# EAGLE design e18_cc2652p (EAGLE 9.6.2)
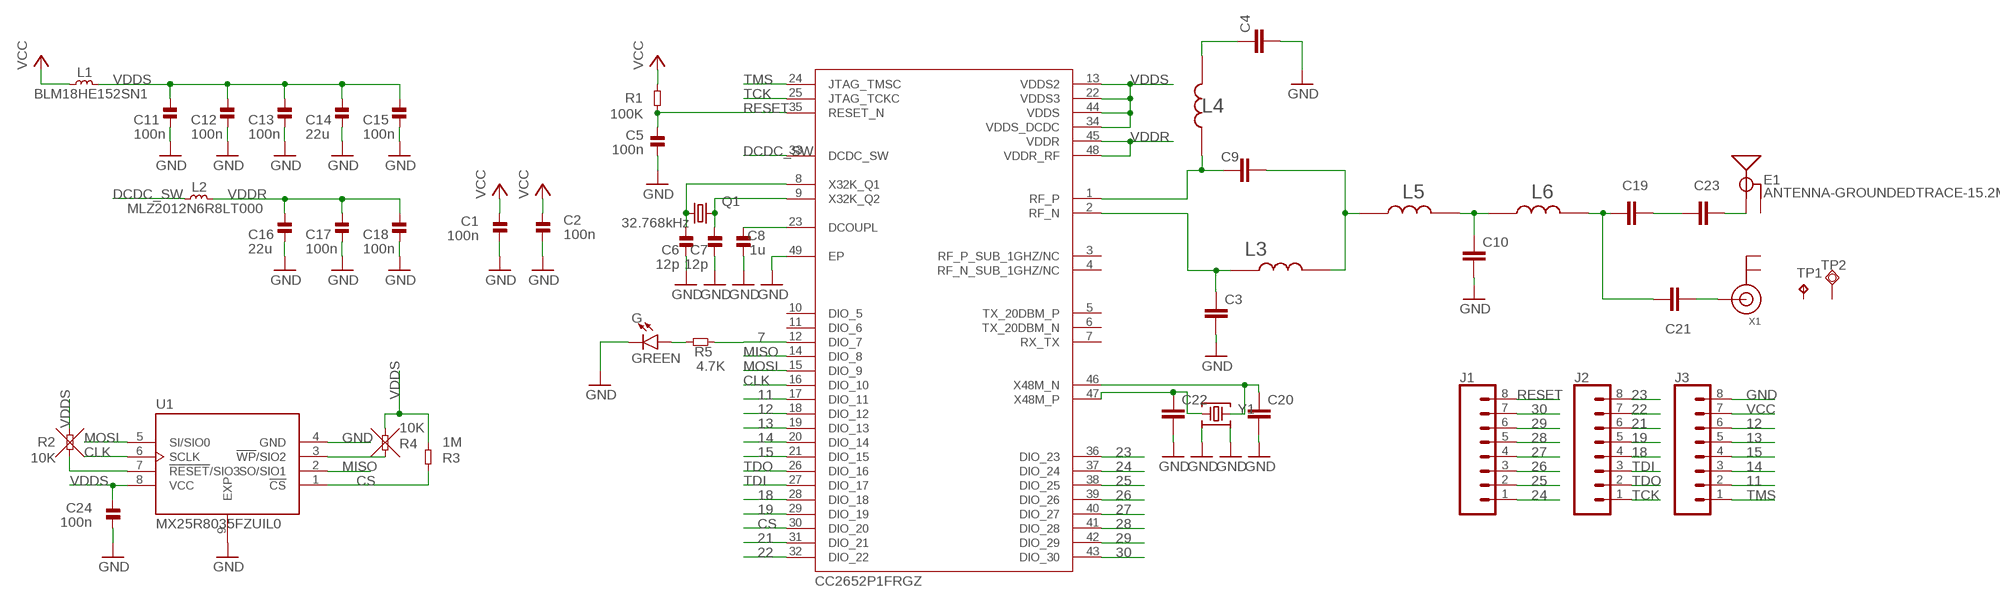
[diagram p0: schematic, sheet 1]

## Parts
C1  100n  CAP-0402  [_PKG_C_0402]
C2  100n  CAP-0402  [_PKG_C_0402]
C3  1pf  CAP0402  [CAPC1005X40N]
C4  12pf  CAP0402  [CAPC1005X40N]
C5  100n  CAP-0402  [_PKG_C_0402]
C6  12p  CAP-0402  [_PKG_C_0402]
C7  12p  CAP-0402  [_PKG_C_0402]
C8  1u  CAP-0402  [_PKG_C_0402]
C9  1pf  CAP0402  [CAPC1005X40N]
C10  1pf  CAP0402  [CAPC1005X40N]
C11  100n  CAP-0402  [_PKG_C_0402]
C12  100n  CAP-0402  [_PKG_C_0402]
C13  100n  CAP-0402  [_PKG_C_0402]
C14  22u  CAP-0805  [_PKG_C_0805]
C15  100n  CAP-0402  [_PKG_C_0402]
C16  22u  CAP-0805  [_PKG_C_0805]
C17  100n  CAP-0402  [_PKG_C_0402]
C18  100n  CAP-0402  [_PKG_C_0402]
C19  12pf  CAP0402  [CAPC1005X40N]
C20  6.8pf  CAP0402  [CAPC1005X40N]
C21  2.2pf  CAP0402  [CAPC1005X40N]
C22  6.8pf  CAP0402  [CAPC1005X40N]
C23  1.8pf  CAP0402  [CAPC1005X40N]
C24  100n  CAP-0402  [_PKG_C_0402]
E1  ANTENNA-GROUNDEDTRACE-15.2MM  [TRACE_ANTENNA_2.4GHZ_15.2MM]
G  GREEN  LED-GREEN0603  [LED-0603]
IC3  CC2652P1FRGZ  CC2652P1FRGZRRGZ0048A-MFG  [RGZ0048A-MFG]
J1  CONN_111X8-1.27MM  [1X11-1.27MM]
J2  CONN_111X8-1.27MM  [1X11-1.27MM]
J3  CONN_111X8-1.27MM  [1X11-1.27MM]
L1  BLM18HE152SN1  INDUCTOR-0603  [_PKG_L_0603]
L2  MLZ2012N6R8LT000  INDUCTOR-0805  [_PKG_C_0805]
L3  2.4nH  IND0402IND0402  [INDC1005X40N]
L4  2.4nH  IND0402IND0402  [INDC1005X40N]
L5  2nH  IND0402IND0402  [INDC1005X40N]
L6  2nH  IND0402IND0402  [INDC1005X40N]
Q1  32.768kHz  KX-327-RT  [2.0X1.2]
R1  100K  RES-0402  [_PKG_C_0402]
R2  10K  RES-0402  [_PKG_C_0402]
R3  1M  RES-0402  [_PKG_C_0402]
R4  10K  RES-0402  [_PKG_C_0402]
R5  4.7K  RES-0402  [_PKG_C_0402]
TP1  TPTP06SQ  [TP05SQ]
TP2  TPSQTP15SQ  [TP15SQ]
U1  MX25R8035FZUIL0  [PSON50P200X300X60-9N]
X1  ANTENNA_U.FL  [U.FL]
Y1  Q22FA12800150  48.000MHZ_CX2016DB48000C0FPLC1  [XTAL-4P-2016]

## Nets
7: IC3.12(DIO_7) R5.1
11: IC3.17(DIO_11) J3.2
12: IC3.18(DIO_12) J3.6
13: IC3.19(DIO_13) J3.5
14: IC3.20(DIO_14) J3.3
15: IC3.21(DIO_15) J3.4
18: IC3.28(DIO_18) J2.4
19: IC3.29(DIO_19) J2.5
21: IC3.31(DIO_21) J2.6
22: IC3.32(DIO_22) J2.7
23: IC3.36(DIO_23) J2.8
24: IC3.37(DIO_24) J1.1
25: IC3.38(DIO_25) J1.2
26: IC3.39(DIO_26) J1.3
27: IC3.40(DIO_27) J1.4
28: IC3.41(DIO_28) J1.5
29: IC3.42(DIO_29) J1.6
30: IC3.43(DIO_30) J1.7
CLK: IC3.16(DIO_10) U1.6(SCLK)
CS: IC3.30(DIO_20) R3.2 U1.1(!CS)
DCDC_SW: IC3.33(DCDC_SW) L2.1
GND: C1.1 C2.1 C3.2 C4.2 C5.1 C6.1 C7.1 C8.1 C10.2 C11.2 C12.2 C13.2 C14.2 C15.2 C16.2 C17.2 C18.2 C20.2 C22.2 C24.1 G.C IC3.49(EP) J3.8 U1.4(GND) U1.9(EXP) Y1.2 Y1.4
MISO: IC3.14(DIO_8) U1.2(SO/SIO1)
MOSI: IC3.15(DIO_9) U1.5(SI/SIO0)
N$1: C9.1 IC3.1(RF_P) L4.1
N$2: C3.1 IC3.2(RF_N) L3.1
N$3: C4.1 L4.2
N$4: C9.2 L3.2 L5.1
N$5: C19.1 C21.1 L6.2
N$6: C21.2 X1.3(SIGNAL)
N$7: C19.2 C23.1
N$8: C23.2 E1.ANT(SIGNAL)
N$9: C8.2 IC3.23(DCOUPL)
N$10: C10.1 L5.2 L6.1
N$11: R2.1 U1.7(!RESET!/SIO3)
N$12: C20.1 IC3.46(X48M_N) Y1.3
N$13: R4.2 U1.3(!WP!/SIO2)
N$14: G.A R5.2
N$15: C22.1 IC3.47(X48M_P) Y1.1
RESET: C5.2 IC3.35(RESET_N) J1.8 R1.1
TCK: IC3.25(JTAG_TCKC) J2.1
TDI: IC3.27(DIO_17) J2.3
TDO: IC3.26(DIO_16) J2.2
TMS: IC3.24(JTAG_TMSC) J3.1
VCC: C1.2 C2.2 J3.7 L1.1 R1.2
VDDR: C16.1 C17.1 C18.1 IC3.45(VDDR) IC3.48(VDDR_RF) L2.2
VDDS: C11.1 C12.1 C13.1 C14.1 C15.1 C24.2 IC3.13(VDDS2) IC3.22(VDDS3) IC3.34(VDDS_DCDC) IC3.44(VDDS) L1.2 R2.2 R3.1 R4.1 U1.8(VCC)
X32K_Q1: C6.2 IC3.8(X32K_Q1) Q1.1
X32K_Q2: C7.2 IC3.9(X32K_Q2) Q1.2
Unconnected: E1.GND IC3.3(RF_P_SUB_1GHZ/NC) IC3.4(RF_N_SUB_1GHZ/NC) IC3.5(TX_20DBM_P) IC3.6(TX_20DBM_N) IC3.7(RX_TX) IC3.10(DIO_5) IC3.11(DIO_6) TP1.TP TP2.TP X1.1(GND) X1.2(GND)

## Library data of the parts
C1 C2 C5-C8 C11-C18 C24 = ok-discretes-dev:CAP
C3 C4 C9 C10 C19-C23 = discretes-dev:CAP0402: CAP, 0402; AVAILABILITY: Good; DESCRIPTION: RESISTOR, 0402 0.063W 1% 3M6; Resistance:3.6Mohm; Resistance Tolerance:± 1%; Power Rating:0.063W; Voltage Rating:50V; Series:RC32H; Temperature Coefficient:± 100ppm/°C; Resistor Element Type:Thick Film; Resistor Case Style:0402; No. of Pins:2; SVHC:No SVHC; Case Style:0402; External Length / Height:1mm; Temperature Coeff. +:100ppm/°C; Temperature Coeff. -:100ppm/°C; External Depth:0.35mm; External Width:0.5mm; Operating Temperature Range:-55°C to +155°C; Overload Voltage:100V; MF: Yageo; MP: RC0402FR-073M6L; PACKAGE: 1005 Panasonic Electronic Components; PRICE: None; PURCHASE-URL: https://pricing.snapeda.com/search/part/RC0402FR-073M6L/?ref=eda
E1 = SparkFun-RF2:ANTENNA-GROUNDED: Antenna w/ Ground Connection 2.4GHz antennae with signal and ground terminals. TRACE_ANTENNA_2.4GHZ_15.2MM - Meander Trace antenna 15.2 x 5.7mm footprint Based on layout from TI app note AN043 <http://www.ti.com/lit/an/swra117d/swra117d.pdf>. TRACE_ANTENNA_2.4GHZ_25.7MM - Inverted F trace antenna 25.7 x 7.5 mm footprint. Based on layout from TI design note DN0007 <http://www.ti.com/lit/an/swru120b/swru120b.pdf>.
G = SparkFun-LED:LED-GREEN: Green SMD LED Used in manufacturing of various products at SparkFun Packages: 0603 - SMD 0603 package [Product Link] <http://www.futureelectronics.com/en/technologies/semiconductors/optoelectronics/leds/Pages/9894312-LTST-C190GKT.aspx?CrossPart=HSMG-C190&IM=0> LilyPad 1206 - SMD1206 LilyPad package [Product Link] <http://www.futureelectronics.com/en/Technologies/Product.aspx?ProductID=IN150NGHARVATEKCORPORATION2049943&IM=0> 1206 - SMD1206 package [Product Link] <http://www.futureelectronics.com/en/technologies/semiconductors/optoelectronics/leds/Pages/8315665-LTST-C150KGKT.aspx?IM=0> 1206 Bottom Mount -SMD 1206 Bottom Mount [Product Link] <http://www.digikey.com/product-detail/en/lite-on-inc/LTST-C230KGKT/160-1456-1-ND/386854> SparkFun Products: Pro Mini 328 -5V <https://www.sparkfun.com/products/821> RedBoard <https://www.sparkfun.com/products/12757> MP3 Trigger <https://www.sparkfun.com/products/13720> Makey Makey <https://www.sparkfun.com/products/11076>; PROD_ID: DIO-00821
IC3 = CC2652P1FRGZR:CC2652P1FRGZR; COPYRIGHT: Copyright (C) 2022 Ultra Librarian. All rights reserved.; MANUFACTURER_PART_NUMBER: CC2652P1FRGZR; MFR_NAME: Texas Instruments; REFDES: RefDes; TYPE: TYPE
J1-J3 = SparkFun-Connectors:CONN_11: Multi connection point. Often used as Generic Header-pin footprint for 0.1 inch spaced/style header connections On any of the 0.1 inch spaced packages, you can populate with these: Break Away Headers - Straight <https://www.sparkfun.com/products/116> (PRT-00116) Break Away Male Headers - Right Angle <https://www.sparkfun.com/products/553> (PRT-00553) Female Headers <https://www.sparkfun.com/products/115> (PRT-00115) Break Away Headers - Machine Pin <https://www.sparkfun.com/products/117> (PRT-00117) Break Away Female Headers - Swiss Machine Pin <https://www.sparkfun.com/products/743> (PRT-00743) For SCREWTERMINALS and SPRING TERMINALS visit here: Screw Terimnals on SparkFun.com <https://www.sparkfun.com/search/results?term=Screw+Terminals> (5mm/3.5mm/2.54mm spacing) This device is also useful as a general connection point to wire up your design to another part of your project. Our various solder wires solder well into these plated through hole pads. Hook-Up Wire - Assortment (Stranded, 22 AWG) <https://www.sparkfun.com/products/11375> (PRT-11375) Hook-Up Wire - Assortment (Solid Core, 22 AWG) <https://www.sparkfun.com/products/11367> (PRT-11367) View the entire wire category on our website here <https://www.sparkfun.com/categories/141>
L1 L2 = ok-discretes-dev:INDUCTOR
L3-L6 = discretes-dev:IND0402: RESISTOR, 0402 0.063W 1% 3M6; Resistance:3.6Mohm; Resistance Tolerance:± 1%; Power Rating:0.063W; Voltage Rating:50V; Series:RC32H; Temperature Coefficient:± 100ppm/°C; Resistor Element Type:Thick Film; Resistor Case Style:0402; No. of Pins:2; SVHC:No SVHC; Case Style:0402; External Length / Height:1mm; Temperature Coeff. +:100ppm/°C; Temperature Coeff. -:100ppm/°C; External Depth:0.35mm; External Width:0.5mm; Operating Temperature Range:-55°C to +155°C; Overload Voltage:100V Check prices <https://pricing.snapeda.com/parts/RC0402FR-073M6L/Yageo/view-part?ref=eda>; AVAILABILITY: Good; DESCRIPTION: RESISTOR, 0402 0.063W 1% 3M6; Resistance:3.6Mohm; Resistance Tolerance:± 1%; Power Rating:0.063W; Voltage Rating:50V; Series:RC32H; Temperature Coefficient:± 100ppm/°C; Resistor Element Type:Thick Film; Resistor Case Style:0402; No. of Pins:2; SVHC:No SVHC; Case Style:0402; External Length / Height:1mm; Temperature Coeff. +:100ppm/°C; Temperature Coeff. -:100ppm/°C; External Depth:0.35mm; External Width:0.5mm; Operating Temperature Range:-55°C to +155°C; Overload Voltage:100V; MF: Yageo; MP: RC0402FR-073M6L; PACKAGE: 1005 Panasonic Electronic Components; PRICE: None; PURCHASE-URL: https://pricing.snapeda.com/search/part/RC0402FR-073M6L/?ref=eda
Q1 = crystal-geyer_V1_0:KX-327: Tuning Fork Crystals (kHz) SMD: KX327 - Serie Model Size l/w/h [mm] Frequency Range Frequency Stability Temp. Range [°C] Load Capacitance AECQ 200 availabel Datasheet KX-327VT KX-327FT KX-327RT KX-327NHT KX-327NHF KX-327L KX-327S 1.25/1.05/0.5 1.6/1.0/0.5 2.0/1.2/0.6 3.2/1.5/0.8 3.2/1.5/0.8 7.0/1.5/1.4 8.2/3.8/2.5 32,768 kHz 32,768 kHz 32,768 kHz 32,768 kHz 32,768 kHz 32,768 kHz 32,768 kHz ±10 … ±20ppm ±10 … ±20ppm ±10 … ±20ppm ±10 … ±20ppm ±10 … ±20ppm ±10 … ±20ppm ±5 … ±20ppm (*) -40°C …+85°C (*) -40°C …+85°C (*) -40°C …+85°C (*) -40°C …+85°C (*) -40°C …+125°C (*) -40°C …+85°C (*) -40°C …+85°C 7/9/12,5 7/9/12,5 7/9/12,6 7/9/12,5 9/12,5 7/9/12,5 6/12,5 - - - - yes - - KX-327VT.pdf <http://www.geyer-electronic.de/uploads/tx_userartikelfrequenz/GEYER-KX-327VT.pdf> KX-327FT.pdf <http://www.geyer-electronic.de/uploads/tx_userartikelfrequenz/GEYER-KX-327FT.pdf> KX-327RT.pdf <http://www.geyer-electronic.de/uploads/tx_userartikelfrequenz/GEYER-KX-327RT.pdf> KX-327NHT.pdf <http://www.geyer-electronic.de/uploads/tx_userartikelfrequenz/GEYER-KX-327NHT.pdf> KX-327NHF.pdf <http://www.geyer-electronic.de/uploads/tx_userartikelfrequenz/GEYER-KX-327NHF.pdf> KX-327L.pdf <http://www.geyer-electronic.de/uploads/tx_userartikelfrequenz/GEYER-KX-327L.pdf> KX-327S.pdf <http://www.geyer-electronic.de/uploads/tx_userartikelfrequenz/GEYER-KX-327S.pdf> <http://www.geyer-electronic.de/fileadmin/template/img/logo-geyer-electronic.png> Details see: http://www.geyer-electronic.de/Frequenz-Produkte.9.0.html Created 2016-06-07, Hans Locher 2016 (C) Geyer Quartz Technology KX327VT,KX327FT,KX327RT,KX327NHT,KX327NHF,KX327S,KX327L;125105;1610;2012;3215;7015;8238;1,25x1,05,1.25x1.05;1,6x1,0,1.6x1.0;2,0x1,2,2.0x1.2;3,2x1,5,3.2x1.5;8,2x3,8,8.2x3.8,7.0x1.5,7,0x1,532.768kHz
R1-R5 = ok-discretes-dev:RES
TP1 = testpad:TP: Test pad
TP2 = testpad:TPSQ: Test pad
U1 = MX25R8035FZUIL0:MX25R8035FZUIL0: FLASH - NOR Memory IC 8Mb (1M x 8) SPI - Quad I/O 33 MHz 8-USON (2x3) Check availability <https://pricing.snapeda.com/parts/MX25R8035FZUIL0/Macronix/view-part?ref=eda>; AVAILABILITY: In Stock; DESCRIPTION: NOR Flash Serial 1.8V/3.3V 8M-bit 8M/4M/2M x 1/2-bit/4-bit 12ns 8-Pin USON EP; MF: Macronix; MP: MX25R8035FZUIL0; PACKAGE: None; PRICE: None; PURCHASE-URL: https://pricing.snapeda.com/search/part/MX25R8035FZUIL0/?ref=eda
X1 = adafruit:ANTENNA_U.FL: U.FL Antenna Connector
Y1 = ok-xtal-osc-dev:48.000MHZ_CX2016DB48000C0FPLC1: 48MHz ±10ppm Crystal 7pF 50 Ohms 4-SMD, No Lead Datasheet <https://media.digikey.com/pdf/Data%20Sheets/Kyocera%20International/CX2016DB48000C0FPLC1_DS.pdf>; DIGIKEY_PART: 1253-2042-1-ND; MFG_NAME: KYOCERA; MFG_PART: CX2016DB48000C0FPLC1

## Board
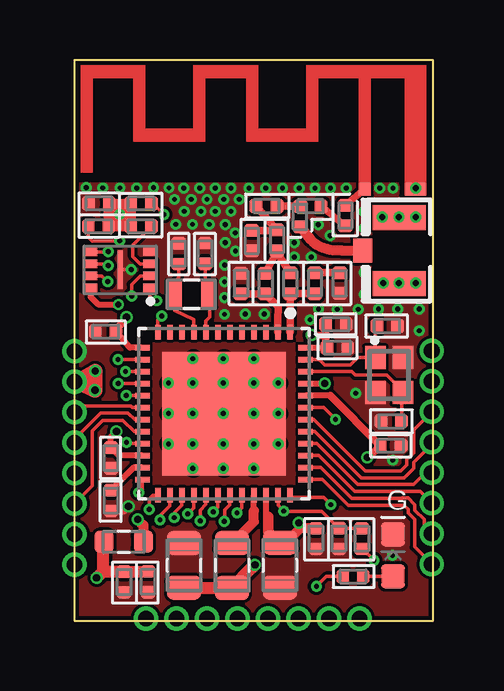
[diagram p1: board, top side]
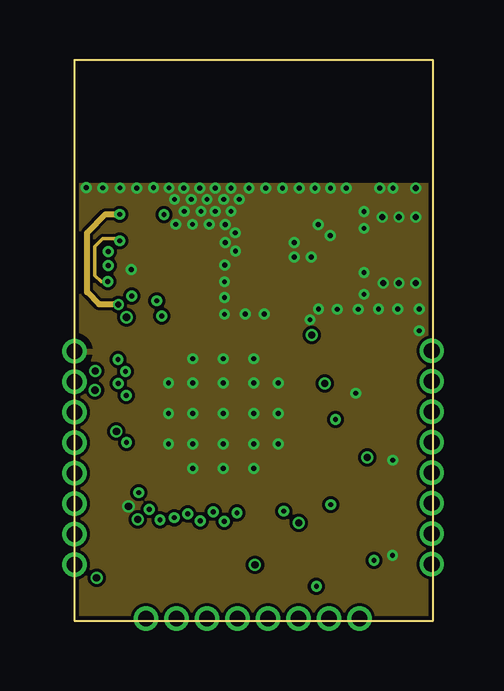
[diagram p2: board, inner layer Route2]
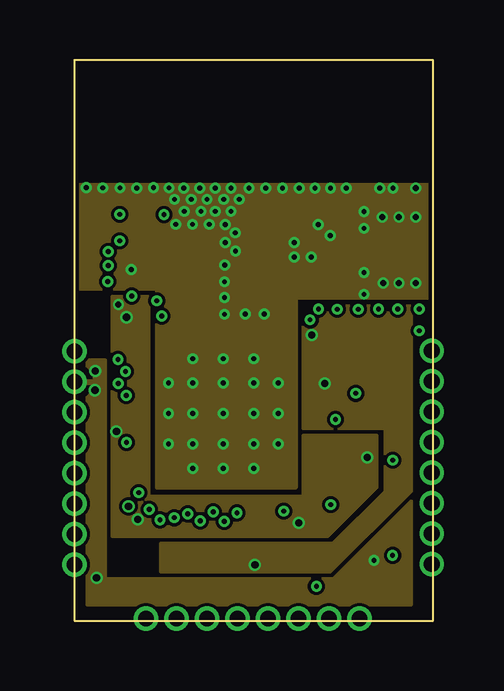
[diagram p3: board, inner layer Route15]
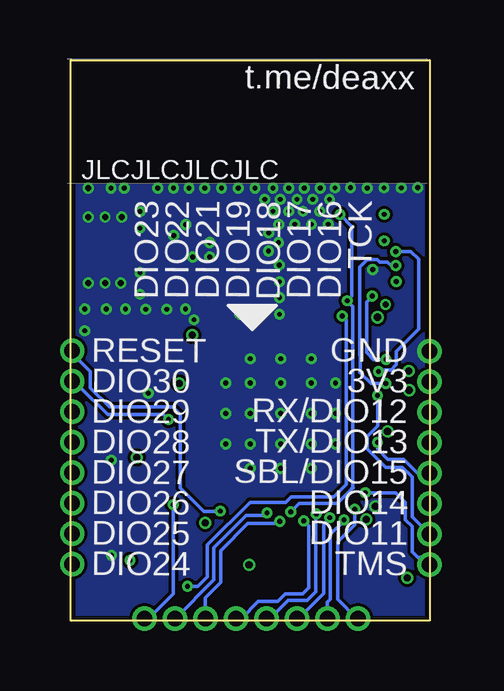
[diagram p4: board, bottom side, seen from below]

Size 14.95 x 23.38 mm. Coordinates in mm from the lower left corner, seen from the top.
Outline: 14.95,0 14.95,23.38 0,23.38 0,0 14.95,0
Copper layers (1*2*15*16): Top 0.035559375mm / dielectric 0.17018125mm / Route2 0.01778125mm / dielectric 0.4mm / Route15 0.01778125mm / dielectric 0.17018125mm / Bottom 0.035559375mm
Design rules "oshpark-4layer *": minimum track width 6mil, minimum drill 0.2mm, track to track 5mil, track to pad 5mil, pad to pad 5mil, via to via 5mil, smd to smd 5mil, copper to edge 0.16mm, drill to drill 0.2mm, minimum pad ring 4mil, minimum via ring 4mil, stop-mask expansion 0.05841875mm, vias tented up to drill 50mil, thermal gap 10mil
tRestrict: area 4.5,13.1 to 5.3,14.2; 1 lines

### Footprints (pad centres in the part's own frame; a part is rotated, then mirrored left to right if it is on the bottom)
_PKG_C_0402 = smd 0.54 x 0.6: 1 -0.43,0; 2 0.43,0
CAPC1005X40N = smd 0.54 x 0.6: 1 -0.432,0; 2 0.432,0
_PKG_C_0805 = smd 1 x 1.42: 1 -0.935,0; 2 0.935,0
TRACE_ANTENNA_2.4GHZ_15.2MM = smd 0.5 x 0.5: ANT -3.127,-0.25 | smd 0.9 x 0.5: GND -1.027,-0.25
LED-0603 = smd 1 x 1: A -0.877,0; C 0.877,0
RGZ0048A-MFG = smd 0.6 x 0.24: 1 -3.4,2.75; 2 -3.4,2.25; 3 -3.4,1.75; 4 -3.4,1.25; 5 -3.4,0.75; 6 -3.4,0.25; 7 -3.4,-0.25; 8 -3.4,-0.75; 9 -3.4,-1.25; 10 -3.4,-1.75; 11 -3.4,-2.25; 12 -3.4,-2.75; 25 3.4,-2.75; 26 3.4,-2.25; 27 3.4,-1.75; 28 3.4,-1.25; 29 3.4,-0.75; 30 3.4,-0.25; 31 3.4,0.25; 32 3.4,0.75; 33 3.4,1.25; 34 3.4,1.75; 35 3.4,2.25; 36 3.4,2.75 | smd 0.24 x 0.6: 13 -2.75,-3.4; 14 -2.25,-3.4; 15 -1.75,-3.4; 16 -1.25,-3.4; 17 -0.75,-3.4; 18 -0.25,-3.4; 19 0.25,-3.4; 20 0.75,-3.4; 21 1.25,-3.4; 22 1.75,-3.4; 23 2.25,-3.4; 24 2.75,-3.4; 37 2.75,3.4; 38 2.25,3.4; 39 1.75,3.4; 40 1.25,3.4; 41 0.75,3.4; 42 0.25,3.4; 43 -0.25,3.4; 44 -0.75,3.4; 45 -1.25,3.4; 46 -1.75,3.4; 47 -2.25,3.4; 48 -2.75,3.4 | smd 5.15 x 5.15: 49 0,0 | smd 0.5 x 0.5: 50 1.26,-2.325; 51 0,-2.325; 52 -1.26,-2.325; 53 1.26,2.325; 54 0,2.325; 55 -1.26,2.325; 56 2.325,-1.26; 57 2.325,0; 58 2.325,1.26; 59 -2.325,-1.26; 60 -2.325,0; 61 -2.325,1.26; 62 0,-1.26; 63 0.025,0; 64 0,1.26; 65 1.26,-1.26; 66 1.26,0; 67 1.26,1.26; 68 -1.26,-1.26; 69 -1.26,0; 70 -1.26,1.26
1X11-1.27MM = drill 0.65 pad 1.016: 1 0,0; 2 1.27,0; 3 2.54,0; 4 3.81,0; 5 5.08,0; 6 6.35,0; 7 7.62,0; 8 8.89,0
_PKG_L_0603 = smd 0.79 x 0.93: 1 -0.82,0; 2 0.82,0
INDC1005X40N = smd 0.54 x 0.6: 1 -0.432,0; 2 0.432,0
2.0X1.2 = smd 0.6 x 1.1: 1 -0.7,0; 2 0.7,0
TP05SQ = smd 0.5 x 0.5: TP 0,0
TP15SQ = smd 0.5 x 0.9: TP 0,0
PSON50P200X300X60-9N = smd 0.56 x 0.35: 1 -1.235,0.75; 2 -1.235,0.25; 3 -1.235,-0.25; 4 -1.235,-0.75; 5 1.235,-0.75; 6 1.235,-0.25; 7 1.235,0.25; 8 1.235,0.75 | smd 0.2 x 1.6: 9 0,0
U.FL = smd 2.2 x 1.05: 1 0,1.375; 2 0,-1.375 | smd 0.8 x 1: 3 1.525,0
XTAL-4P-2016 = smd 0.95 x 0.85: 1 -0.725,-0.575; 2 0.725,-0.575; 3 0.725,0.575; 4 -0.725,0.575

### Placement (x,y rotation side)
C1  2.08,1.61 90 top
C2  3.07,1.62 90 top
C3  6.94,14.06 90 top
C4  11.06,14.07 270 top
C5  11.03,3.42 90 top
C6  5.45,15.31 269.9 top
C7  4.35,15.3 270 top
C8  1.54,5.01 90 top
C9  9,14.06 90 top
C10  7.4,15.84 270 top
C11  1.31,12.05 180 top
C12  1.53,6.78 270 top
C13  13.18,7.29 0 top
C14  8.57,2.31 270 top
C15  10.07,3.42 270 top
C16  4.57,2.3 90 top
C17  10.96,11.38 0 top
C18  10.9,12.35 0 top
C19  9.85,17.27 0 top
C20  13.21,8.32 180 top
C21  9.41,16.84 270 top
C22  13.04,12.28 0 top
C23  11.29,16.88 90 top
C24  1.03,17.4 0 top
E1  15.24,18.23 0 top
G  13.28,2.72 90 top
IC3  6.24,8.63 270 top
J1  14.9,2.36 90 top
J2  2.99,0.08 0 top
J3  0.02,2.34 90 top
L1  2.06,3.29 0 top
L2  6.58,2.3 270 top
L3  7.96,14.05 90 top
L4  10.02,14.06 90 top
L5  8.44,15.86 90 top
L6  8.01,17.28 0 top
Q1  4.88,13.61 180 top
R1  11.98,3.42 270 top
R2  1.01,16.44 0 top
R3  2.79,17.4 0 top
R4  2.79,16.44 0 top
R5  11.62,1.84 0 top
TP1  12.11,17.99 0 top
TP2  14.22,17.98 90 top
U1  1.91,14.63 180 top
X1  13.54,15.43 180 top
Y1  13.12,10.24 270 top

### Tracks (layer width: path | path; a pad name or v marks a point on that pad's centre or on a via)
7  (via drill 0.2 pad 0.45)
  Top 0.152: IC3.12 3.49,12.54 v3.65,12.7 | R5.1 10.5,1.84 v10.09,1.43
  Bottom 0.152: v3.65,12.7 v3.64,12.7 3.48,12.53 3.48,5.67 3.99,5.16 5.77,5.16 6,4.93 7.49,4.93 9.27,3.15 9.27,1.82 9.66,1.43 v10.09,1.43
11  (via drill 0.2 pad 0.45)
  Top 0.152: IC3.17 v2.17,9.38
  Bottom 0.152: v2.17,9.38 2.17,8.11 2.6,7.68 2.6,7.15 1.84,6.38 1.14,6.38 0.74,5.98 0.74,4.33 J3.2
12
  Top 0.152: IC3.18 2.41,8.88 2.35,8.95 0.28,8.95 J3.6
13
  Top 0.152: IC3.19 2.52,8.38 2.23,8.67 1.11,8.67 0.02,7.57 J3.5
14
  Top 0.152: IC3.20 2.49,7.88 2.02,8.36 1.19,8.36 0.75,7.92 0.75,5.61 J3.3
15  (via drill 0.2 pad 0.45)
  Top 0.152: IC3.21 2.23,7.38 v2.17,7.43
  Bottom 0.152: v2.17,7.43 2.17,7.16 1.74,6.73 1.08,6.73 0.5,6.15 J3.4
18  (via drill 0.2 pad 0.45)
  Top 0.152: IC3.28 4.99,4.71 v4.73,4.45
  Bottom 0.152: v4.73,4.45 4.75,4.44 4.75,1.2 5.1,0.85 5.9,0.85 6.66,0.08 J2.4
19  (via drill 0.2 pad 0.45)
  Top 0.152: IC3.29 5.49,4.84 5.25,4.6 v5.25,4.15 | v5.25,4.15
  Bottom 0.152: 7.83,0.08 J2.5 7.86,0.08 7.14,0.8 6.34,0.8 6.02,1.13 5.29,1.13 5.05,1.37 5.05,3.95 v5.25,4.15
21  (via drill 0.2 pad 0.45)
  Top 0.152: IC3.31 6.49,4.83 6.26,4.61 6.26,4.15 v6.25,4.14
  Bottom 0.152: v6.25,4.14 6.34,4.05 7.58,4.05 8.71,2.92 8.71,1.59 9.34,0.96 J2.6
22  (via drill 0.2 pad 0.45)
  Top 0.152: IC3.32 6.99,4.69 v6.78,4.49
  Bottom 0.152: v6.78,4.49 v6.79,4.49 6.89,4.38 7.64,4.38 8.99,3.03 8.99,1.71 J2.7
23  (via drill 0.2 pad 0.45)
  Top 0.152: v10.69,4.83 10.39,5.13 9.08,5.13 IC3.36
  Bottom 0.152: v10.69,4.83 10.69,1.13 11.73,0.08 J2.8
24
  Top 0.152: IC3.37 10.33,5.88 11.41,4.81 13.74,4.81 13.91,4.63 13.91,4.49 14.19,4.21 14.19,3.07 J1.1
25
  Top 0.152: 14.89,3.63 J1.2 14.57,3.95 14.57,4.22 14.19,4.61 14.19,4.83 13.91,5.11 13.66,5.11 13.66,5.1 11.56,5.1 10.28,6.38 IC3.38
26
  Top 0.152: IC3.39 10.19,6.88 11.69,5.39 14.41,5.39 J1.3
27
  Top 0.152: J1.4 14.65,6.17 14.15,5.68 11.81,5.68 10.1,7.38 IC3.40
28
  Top 0.152: J1.5 14.9,7.35 14.14,6.59 14.14,6.35 13.74,5.96 11.95,5.96 10.03,7.88 IC3.41
29
  Top 0.152: J1.6 | IC3.42 9.99,8.38 12.12,6.25 13.6,6.25 13.86,6.5 13.86,6.71 14.14,7 14.14,7.95 14.57,8.39 | 14.57,8.39 14.56,8.4 | J1.6 14.57,8.39
30  (via drill 0.2 pad 0.45)
  Top 0.152: IC3.43 10.39,8.88 v10.89,8.38
  Bottom 0.152: v10.89,8.38 11.1,8.6 13.42,8.6 14.57,9.75 14.67,9.75 J1.7
CLK  (via drill 0.2 pad 0.45)
  Top 0.152: IC3.16 v1.84,9.88 | U1.6 1.33,14.88 v1.41,14.8
  Bottom 0.152: v1.84,9.88 2.44,9.88 2.89,10.33 | 2.91,10.35 2.89,10.33 | 2.89,10.33 2.89,11.04 2.91,11.06 2.91,14.75 2.6,15.06 2.19,15.06 2.09,14.96 1.77,14.96 1.61,14.8 v1.41,14.8
CS  (via drill 0.2 pad 0.45)
  Top 0.152: IC3.30 5.99,4.73 v5.79,4.53 | R3.2 3.28,17.4 v3.74,16.93 | U1.1 3.15,13.53 3.34,13.33 v3.44,13.33
  Bottom 0.152: 3.19,5.53 3.24,5.48 | 3.24,5.48 3.84,4.88 5.44,4.88 v5.79,4.53 | 3.24,5.48 3.24,5.52 3.2,5.56 3.2,13.09 v3.44,13.33 3.24,13.53 3.24,16.44 v3.74,16.93
DCDC_SW
  Top 0.254: 7.49,4.59 IC3.33
  Top 0.406: 6.55,3.26 L2.1 | L2.1 6.45,3.36 | 6.61,3.23 L2.1 | 6.87,3.32 6.78,3.23 L2.1 | 7.49,4.59 7.49,4.12 6.6,3.23 L2.1 | L2.1 6.65,3.23
GND  (via drill 0.2 pad 0.45, 0.25 pad 0.45, 0.3)
  Top 0.152: Y1.2 12.54,9.43 | IC3.49 v4.95,8.63 v4.94,8.63 | U1.9 1.92,14.63 v2.37,14.63
  Top 0.254: C17.2 | C18.2 11.33,12.39 | C8.1 1.63,4.58
  Top 0.305: C8.1 2.07,4.58 v2.26,4.77
  other vias: 8.5,7.36 8.5,8.63 8.5,9.9 7.48,9.9 7.48,10.92 6.21,10.92 4.94,10.92 3.93,9.9 3.93,8.63 3.93,7.36 4.94,7.36 4.94,9.9 4.94,6.35 6.21,6.35 7.48,6.35 6.21,7.36 6.21,8.63 6.21,9.9 7.48,8.63 7.48,7.36 6.26,13.47 6.26,14.13 6.27,14.83 6.72,15.41 7.91,12.78 7.12,12.78 10.96,12.98 11.83,12.98 14.38,12.99 11.73,9.48 14.38,12.09 12.68,12.99 13.48,12.99 13.27,6.69 10.18,12.99 6.29,16.52 6.53,18.03 5.88,18.03 5.23,18.03 4.57,18.03 3.94,18.04 5.28,17.07 4.58,17.07 4.23,16.53 4.93,16.53 6.26,12.77 13.26,2.72 0.49,18.06 1.19,18.04 1.91,18.04 2.6,18.04 3.3,18.05 5.63,16.53 5.88,17.07 6.53,17.07 4.88,17.57 5.53,17.57 6.23,17.57 4.18,17.57 7.28,18.03 7.98,18.03 8.68,18.03 10.03,18.03 10.68,18.03 11.33,18.03 9.38,18.03 12.73,18.03 14.23,18.03 6.88,17.57 6.71,16.17 6.3,15.76 13.53,16.83 12.83,16.83 14.23,16.83 13.53,14.08 12.88,14.08 14.23,14.08 9.17,15.76 9.87,15.16 10.17,16.51 10.67,16.06 12.07,17.06 12.07,16.36 12.07,14.51 12.07,13.61 9.17,15.16 9.83,12.54 13.28,18.03
  pour Route15: 3.44,5.54 9.22,5.54 9.26,5.57 9.26,13.45 14.96,13.45 14.96,18.19 0.08,18.19 0.08,13.82 3.44,13.82
  pour Route2: 0.08,18.19 0.08,0.12 14.98,0.12 14.98,18.19
  pour Top (no thermals): 0.08,0.11 14.97,0.11 14.97,18.2 0.08,18.2
  pour Bottom (no thermals): 0.06,0.12 14.96,0.12 14.96,18.19 0.06,18.19
MISO  (via drill 0.2 pad 0.45)
  Top 0.152: IC3.14 v1.83,10.88 v1.82,10.89 | 3.05,14.28 U1.2 2.75,14.38 2.39,14.02 v2.39,13.53 2.34,13.53
  Bottom 0.152: v1.82,10.89 2.34,10.89 2.63,11.18 2.63,13.28 2.39,13.52 v2.39,13.53
MOSI  (via drill 0.2 pad 0.45)
  Top 0.152: IC3.15 v2.14,10.38 | U1.5 1.41,15.38 v1.42,15.39
  Bottom 0.152: v2.14,10.38 2.06,10.45 1.61,10.45 1.39,10.68 1.39,11.23 0.46,12.16 0.46,15.07 0.78,15.39 v1.41,15.39 v1.42,15.39
N$1
  Top 0.305: 8.99,12.33 C9.1 L4.1 | 8.99,12.33 IC3.1 | IC3.1 8.99,12.33 | L4.1
N$2
  Top 0.305: L3.1 7.84,13.62 | 7.92,13.66 L3.1 | C3.1 6.95,13.61 L3.1 | L3.1 | IC3.2 8.49,12.54 8.49,13.09 L3.1
N$3
  Top 0.305: 10.03,14.51 L4.2 C4.1
N$4
  Top 0.305: C9.2 9,14.51 | 8.01,14.53 L3.2 8.44,15.36 | C9.2 9,14.55 | 8.44,15.36 L5.1 | C9.2 8.44,15.36
N$5
  Top 0.305: C21.1 C19.1 L6.2
N$6
  Top 0.406: C21.2 9.74,16.01 arc50 10.92,15.44 arc4 11.13,15.43 X1.3
N$7
  Top 0.305: C19.2 C23.1
N$8
  Top 0.305: E1.ANT C23.2
N$9
  Top 0.254: IC3.23 2.47,6.38 1.54,5.45 C8.2
N$10
  Top 0.305: L6.1 L5.2 8.43,16.27 C10.1
N$11  (via drill 0.2 pad 0.45)
  Top 0.152: 0.58,16.55 R2.1 0.59,16.42 0.59,15.98 0.74,15.83 v1.89,15.83 | U1.7 1.15,14.38 v1.4,14.13
  Route2 0.152: v1.4,14.13 1.12,14.13 0.86,14.39 0.86,15.59 1.19,15.93 1.8,15.93 v1.89,15.83
N$12
  Top 0.152: IC3.46 11.56,10.38 11.7,10.24 13.01,10.24 13.69,9.55 Y1.3 13.64,9.46 C20.1
N$13
  Top 0.152: U1.3 2.75,14.88 2.44,15.18 2.44,15.66 R4.2
N$14
  Top 0.152: R5.2 G.A
N$15
  Top 0.152: 12.56,12.23 C22.1 12.54,12.22 Y1.1 | Y1.1 12.44,10.86 | 9.65,10.86 IC3.47 10.21,10.88 10.43,10.66 11.5,10.66 11.81,10.97 Y1.1
RESET  (via drill 0.2 pad 0.45)
  Top 0.152: C5.2 | IC3.35 8.49,4.8 v8.73,4.56 10.32,4.56 C5.2 | C5.2 R1.1
  Bottom 0.152: J1.8 14.9,11.14 14.14,10.38 14.14,9.71 13.34,8.91 10.7,8.91 10.39,8.6 10.39,5.53 9.42,4.56 v8.73,4.56
TCK  (via drill 0.2 pad 0.45)
  Top 0.152: IC3.25 3.27,5.23 3.12,5.08 v3.12,4.64
  Bottom 0.152: v3.12,4.64 3.12,4 3.84,3.28 3.84,0.88 3.04,0.08 J2.1
TDI  (via drill 0.2 pad 0.45)
  Top 0.152: IC3.27 4.48,4.81 4.17,4.5 v4.17,4.29
  Bottom 0.152: J2.3 5.47,0.08 4.42,1.14 4.42,4.04 v4.17,4.29
TDO  (via drill 0.2 pad 0.45)
  Top 0.152: IC3.26 3.99,4.77 3.57,4.36 v3.57,4.2
  Bottom 0.152: J2.2 4.26,0.75 4.14,0.88 4.14,3.6 3.57,4.16 v3.57,4.2
TMS  (via drill 0.2 pad 0.45)
  Top 0.152: IC3.24 2.84,5.48 v2.69,5.33
  Bottom 0.152: v2.69,5.33 1.41,5.33 1.01,4.93 1.01,4.21 0.73,3.92 0.73,2.87 0.49,2.63 0.31,2.63 J3.1
VCC  (via drill 0.2 pad 0.45, 0.3)
  Top 0.152: R1.2 12.01,2.99 v12.49,2.51
  Top 0.254: R1.2
  Top 0.508: C2.2 C1.2 1.2,2.04 | 1.2,2.04 1.19,2.04 v0.93,1.78 | 1.2,2.04 1.2,3.25 L1.1
  Top 0.61: J3.7 0.06,9.96 v0.88,10.4 0.88,9.61 v0.86,9.61 0.2,9.9 0.03,9.94 J3.7
  pour Route15: 0.54,10.87 1.29,10.87 1.29,1.75 10.8,1.75 14.04,5 14.04,0.66 0.54,0.66
VDDR  (via drill 0.3)
  Top 0.254: IC3.45 v10.43,9.88 v10.44,9.89 | IC3.48 10.46,11.38 10.47,11.36
  Top 0.305: C17.1 10.53,11.48 | C17.1 10.53,11.51 | 10.47,11.44 C18.1 10.47,11.89 9.9,11.89 v9.89,11.9 | 10.47,11.44 10.47,11.36 | 10.47,11.44 C17.1
  Top 0.508: C16.1 L2.2 7.42,2.21 v7.53,2.32
  pour Route15: 9.54,8.02 12.95,8.02 12.95,5.39 10.77,3.21 3.6,3.21 3.6,2.03 10.67,2.03 14.03,5.39 14.03,13.12 9.54,13.12
VDDS  (via drill 0.2 pad 0.45, 0.25, 0.3, 0.3 pad 0.45)
  Top 0.254: IC3.22 1.86,6.88 C12.1 1.53,7.66 v1.76,7.88 | 10.67,9.38 IC3.44 | IC3.13 2.32,11.38 C11.1 | 8.07,3.73 7.99,3.8 IC3.34 | U1.8 0.68,13.5 0.99,13.18 v1.84,13.18
  Top 0.305: 12.75,7.36 C13.1 | 1.83,11.96 C11.1 1.74,12.15 2.19,12.61 v2.18,12.65 | C13.1 10.67,9.38 | C13.1 12.26,6.8 v12.21,6.8
  Top 0.406: C15.1 9.45,3.85 | 9.45,3.85 9.41,3.85 8.8,3.24 C14.1 | 9.45,3.85 v9.35,4.08 | v2.64,4.22 2.88,3.98 L1.2 | 8.08,4.35 8.08,3.71 | C14.1 8.08,3.71 | 8.08,3.71 8.08,3.72 | 8.08,3.72 8.07,3.72 | 8.07,3.72 8.07,3.73 | C14.1 8.08,3.72 | C14.1 8.07,3.72 | R4.1 2.36,16.5 2.36,17.35 | C24.2 1.46,17.37 1.91,16.92 1.91,16.89 R4.1 | v1.91,16.95 v1.9,16.94 1.94,16.94 | R2.2 1.94,16.94 | R2.2 1.44,17.38 C24.2 | C24.2 R3.1 2.36,17.35 | R4.1 R2.2 | 1.94,16.94 2.36,17.35
  Route2 0.254: v1.84,13.18 1.04,13.18 0.53,13.69 0.53,16.17 1.3,16.94 v1.9,16.94
  pour Route15: 12.61,7.73 12.61,5.56 10.57,3.51 1.58,3.51 1.58,13.51 3.1,13.51 3.1,5.19 9.55,5.19 9.55,7.73
X32K_Q1
  Top 0.152: IC3.8 5.49,12.5 5.64,12.65 5.64,13.56 Q1.1 5.58,14.14 5.45,14.27 C6.2
X32K_Q2
  Top 0.152: C7.2 4.35,14.3 4.18,14.13 Q1.2 4.19,12.93 4.98,12.55 4.99,12.54 IC3.9

### Text on the board
tNames: G
bNames: t.me/deaxx | JLCJLCJLCJLC | TCK | DIO16 | DIO17 | DIO18 | DIO19 | DIO21 | DIO22 | DIO23 | GND | RESET | 3V3 | RX/DIO12 | DIO30 | TX/DIO13 | DIO29 | DIO28 | SBL/DIO15 | DIO14 | DIO27 | DIO11 | DIO26 | TMS | DIO25 | DIO24